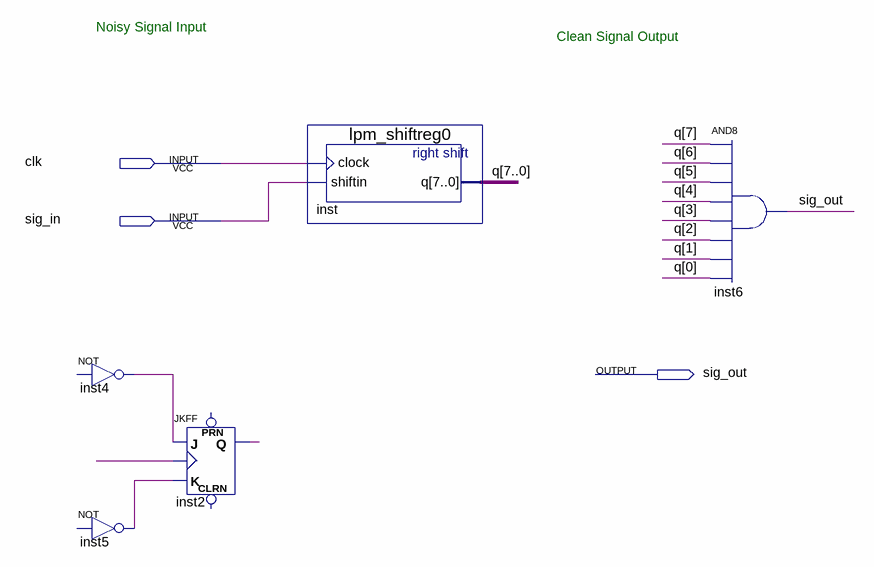
[diagram p0: schematic sheet]
// Quartus schematic debounce.bdf as structural Verilog: 5 symbols, 3 pins
module debounce (
  input  clk,
  input  sig_in,
  output sig_out
);

  wire inst2_q, inst4_out, inst5_out, undriven;
  wire [7:0] q;

  // NOT inst4 has open pins: IN=open, OUT=inst4_out
  // NOT inst5 has open pins: IN=open, OUT=inst5_out
  JKFF inst2 (.K(inst5_out), .J(inst4_out), .CLK(undriven), .Q(inst2_q));  // open: PRN, CLRN
  lpm_shiftreg0 inst (.clock(clk), .shiftin(sig_in), .q(q));
  and inst6 (sig_out, q[7], q[6], q[5], q[4], q[3], q[2], q[1], q[0]);

  // Notes on the sheet:
  //   Noisy Signal Input
  //   Clean Signal Output
endmodule
